# EAGLE schematic Schematic (EAGLE 9.6.2)
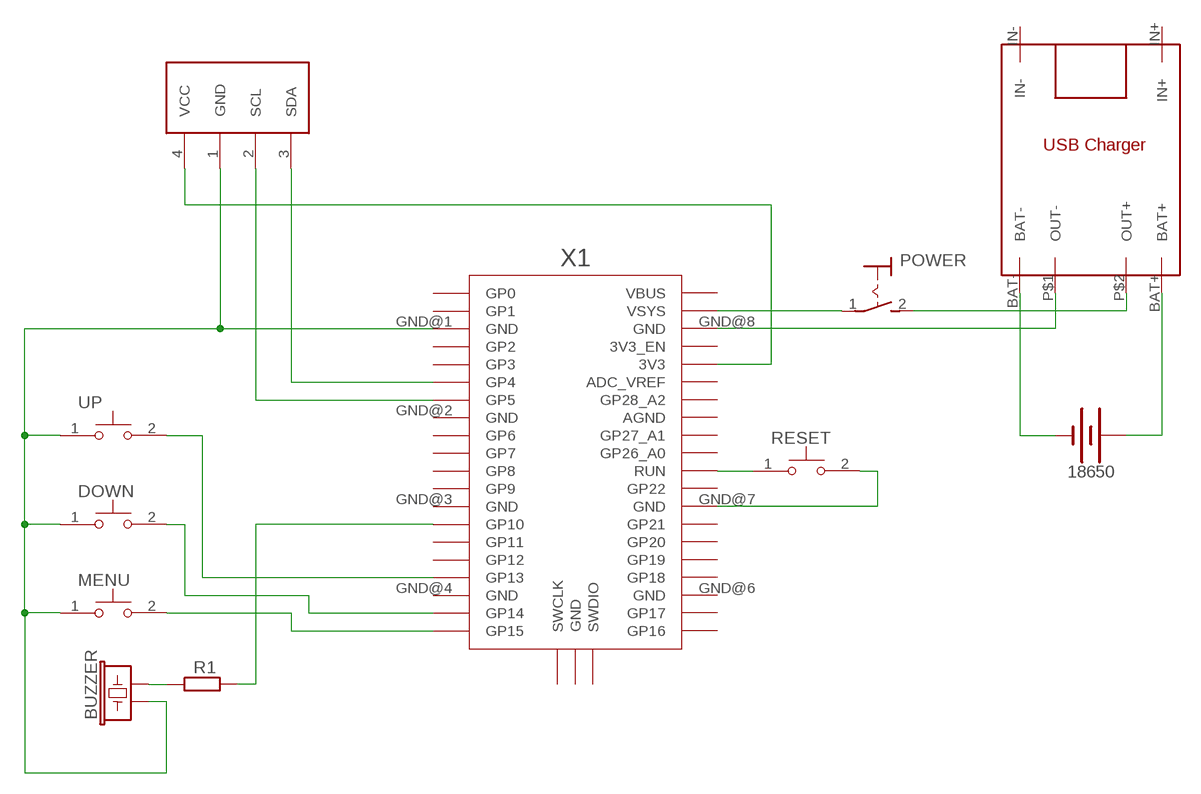
[diagram p0: schematic, sheet 1]

## Parts
18650  BATTERY-18650  [BATTERY_18650-HOLDER]
BUZZER  BUZZER-PTH_KIT  [BUZZER-12MM-KIT]
DOWN  BUTT-2  [SW_BUTT-2]
MENU  BUTT-2  [SW_BUTT-2]
POWER  MS243  [MS243]
R1  R-EU_0207/10  [0207/10]
RESET  BUTT-2  [SW_BUTT-2]
U$1  I2C_OLED  [I2C_OLED_PACKAGE]
U$2  TP4056  [TP4056]
UP  BUTT-2  [SW_BUTT-2]
X1  RPI_PICO_IG-TH  [RPI_PICO_TH]

## Nets
N$1: U$1.4(VCC) X1.3V3
N$2: BUZZER.- R1.1
N$3: R1.2 X1.GP10
N$4: BUZZER.+ DOWN.1 MENU.1 U$1.1(GND) UP.1 X1.GND@1(GND)
N$5: MENU.2 X1.GP15
N$6: DOWN.2 X1.GP14
N$7: UP.2 X1.GP13
N$8: U$1.3(SDA) X1.GP4
N$9: U$1.2(SCL) X1.GP5
N$10: RESET.1 X1.RUN
N$11: RESET.2 X1.GND@7(GND)
N$12: U$2.P$1(OUT-) X1.GND@8(GND)
N$13: POWER.2(S) U$2.P$2(OUT+)
N$14: POWER.1(P) X1.VSYS
N$15: 18650.GND@1(-) U$2.BAT-
N$16: 18650.PWR@1(+) U$2.BAT+
Unconnected: U$2.IN+ U$2.IN- X1.3V3_EN X1.ADC_VREF X1.AGND X1.GND@2(GND) X1.GND@3(GND) X1.GND@4(GND) X1.GND@5(GND) X1.GND@6(GND) X1.GP0 X1.GP1 X1.GP2 X1.GP3 X1.GP6 X1.GP7 X1.GP8 X1.GP9 X1.GP11 X1.GP12 X1.GP16 X1.GP17 X1.GP18 X1.GP19 X1.GP20 X1.GP21 X1.GP22 X1.GP26_A0 X1.GP27_A1 X1.GP28_A2 X1.SWCLK X1.SWDIO X1.VBUS

## Library data of the parts
18650 = SparkFun-Batteries:BATTERY: Battery - Single Cell A variety of battery chemistries, sizes, and footprints. Device List: 20MM_PTH - Coin Cell Battery Holder - 20mm (PTH) <https://www.sparkfun.com/products/783> 20MM_PTH_KIT- Coin Cell battery Holder - 20 mm (PTH) <http://www.sparkfun.com/products/783>kit version with special mask 6.8MM_PTH - Coin Cell Battery Holder - 6.8MM(SMD) <https://www.digikey.com/product-detail/en/seiko-instruments/MS621FE-FL11E/728-1057-ND/1889208?WT.srch=1&gclid=CNOQ5a6LzdQCFZS2wAodXCkE0g> 12MM_SMD - Coin Cell Battery Holder - 12mm (SMD) <https://www.sparkfun.com/products/10592> 12MM_PTH - Coin Cell Battery Holder - 12mm (PTH) <https://www.sparkfun.com/products/7948> 20MM_SMD - 20mm Coin Cell Battery Holder (SMD) (2 legs) Used on the Big Time Watch Kit <https://www.sparkfun.com/products/11734> 20MM_SMD_4LEGS - Coin Cell Battery Holder - 20mm (SMD) <https://www.sparkfun.com/products/11892> 20MM_SMD_4LEGS_OVERPASTE - Coin Cell Battery Holder - 20mm (SMD) <https://www.sparkfun.com/products/11892> (Over-paste on the legs) 24.5MM_PTH - Coin Cell Battery Holder - 24.5mm (PTH) <https://www.sparkfun.com/products/8863> 9V - 9V Battery Holder - PC Mount Used on the SparkFun SparkPunk Sound Kit <https://www.sparkfun.com/products/11177> and SparkFun SparkPunk Sequencer Kit <https://www.sparkfun.com/products/12707> 18650 - Battery Holder - 18650 (PTH) <https://www.sparkfun.com/products/13113> AA - Battery Holder - 1xAA (PTH) <https://www.sparkfun.com/products/7949> AAA - Battery Holder - 1xAAA (PTH) <https://www.sparkfun.com/products/12718> AA_KIT - Battery Holder - 1xAA (PTH) <https://www.sparkfun.com/products/7949> Special kit package - pads only have exposed copper on one side of the board. AAA_KIT - Battery Holder - 1xAAA (PTH) <https://www.sparkfun.com/products/12718> Special kit package - pads only have exposed copper on one side of the board.; PROD_ID: BATT-12327; SF_SKU: PRT-13113
BUZZER = SparkFun-Electromechanical:BUZZER: Buzzer Small round buzzers that operate around the audible 2kHz range. You can use these as speakers to create simple music or user interfaces. Variant Overview: PTH - Mini Speaker - PC Mount 12mm 2.048kHz <https://www.sparkfun.com/products/7950> PTH_KIT - Mini Speaker - PC Mount 12mm 2.048kHz <https://www.sparkfun.com/products/7950> KIT simplifies soldering by adding stop mask to one side of the pads. PTH_NO_SILK - Mini Speaker - PC Mount 12mm 2.048kHz <https://www.sparkfun.com/products/7950> No silkscreen indicator of buzzer outline. PTH_KIT_NO_SILK - Mini Speaker - PC Mount 12mm 2.048kHz <https://www.sparkfun.com/products/7950> KIT package w/o silkscreen SMD - Buzzer Audio Magnetic (CCV-084B16) SMD buzzer used on, e.g. the LilyPad Buzzer <https://www.sparkfun.com/products/8463> and RFID USB Reader <https://www.sparkfun.com/products/9963>. SMD_KIT - Buzzer Audio Magnetic (CCV-084B16) SMD Buzzer with elongated pins to make soldering easier. Used on the SparkFun Simon Says - Surface Mount Soldering Kit <https://www.sparkfun.com/products/10935>. SMD-SQUARE - Buzzer Audio Magnetic (COMP-15701) SMT square buzzer with one chamfered corner.; PROD_ID: COMP-08253; SF_SKU: COM-07950
DOWN MENU RESET UP = BUTT-2:BUTT-2: Tactile Switches MINI PUSH BUTTON SWITCH 2-PIN QTY. 4 Check availability <https://pricing.snapeda.com/parts/BUTT-2/Gravitech/view-part?ref=eda>; AVAILABILITY: In Stock; CHECK_PRICES: https://www.snapeda.com/parts/BUTT-2/Gravitech/view-part/?ref=eda; DESCRIPTION: Tactile Switches MINI PUSH BUTTON SWITCH 2-PIN QTY. 4; MF: Gravitech; MP: BUTT-2; PACKAGE: None; PRICE: None; SNAPEDA_LINK: https://www.snapeda.com/parts/BUTT-2/Gravitech/view-part/?ref=snap
POWER = switch:MS243: TOGGLE SWITCH
R1 = rcl:R-EU_: RESISTOR, European symbol; SPICEPREFIX: R
U$1 = DIYMall_OLED:I2C_OLED
U$2 = TP4056 charging module:TP4056
X1 = RaspberryPi_Pico:RPI_PICO_IG